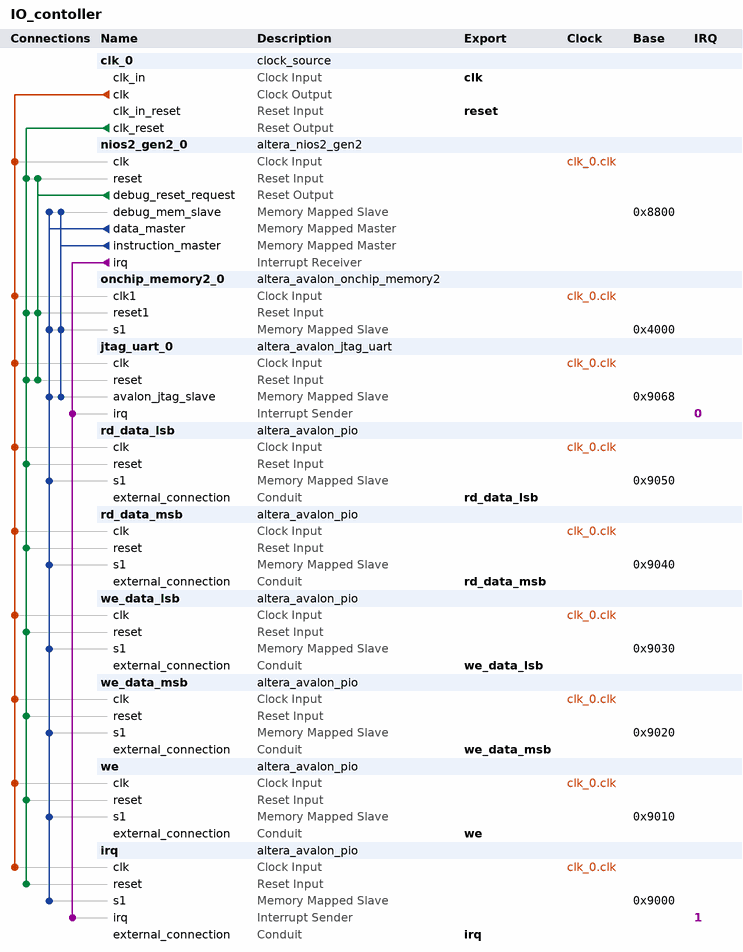
[diagram p0: system contents]
# Platform Designer (Qsys) system IO_contoller, Cyclone IV E EP4CE22F17C6
# Parameters at their usual value, and those the tool derives, are not listed.
package require -exact qsys 23.1
create_system IO_contoller
set_project_property DEVICE_FAMILY {Cyclone IV E}
set_project_property DEVICE EP4CE22F17C6

add_instance clk_0 clock_source 23.1
set_instance_parameter_value clk_0 clockFrequency 50000000

add_instance nios2_gen2_0 altera_nios2_gen2 23.1
set_instance_parameter_value nios2_gen2_0 dcache_size 2048
set_instance_parameter_value nios2_gen2_0 exceptionSlave onchip_memory2_0.s1
set_instance_parameter_value nios2_gen2_0 icache_size 4096
set_instance_parameter_value nios2_gen2_0 impl Tiny
set_instance_parameter_value nios2_gen2_0 resetSlave onchip_memory2_0.s1

add_instance onchip_memory2_0 altera_avalon_onchip_memory2 23.1
set_instance_parameter_value onchip_memory2_0 dataWidth 32
set_instance_parameter_value onchip_memory2_0 dualPort false
set_instance_parameter_value onchip_memory2_0 initMemContent true
set_instance_parameter_value onchip_memory2_0 initializationFileName onchip_mem.hex
set_instance_parameter_value onchip_memory2_0 memorySize 10240

add_instance jtag_uart_0 altera_avalon_jtag_uart 23.1
set_instance_parameter_value jtag_uart_0 simInteractiveOptions NO_INTERACTIVE_WINDOWS

add_instance rd_data_lsb altera_avalon_pio 23.1
set_instance_parameter_value rd_data_lsb direction Input
set_instance_parameter_value rd_data_lsb width 32

add_instance rd_data_msb altera_avalon_pio 23.1
set_instance_parameter_value rd_data_msb direction Input
set_instance_parameter_value rd_data_msb width 32

add_instance we_data_lsb altera_avalon_pio 23.1
set_instance_parameter_value we_data_lsb direction Output
set_instance_parameter_value we_data_lsb width 32

add_instance we_data_msb altera_avalon_pio 23.1
set_instance_parameter_value we_data_msb direction Output
set_instance_parameter_value we_data_msb width 32

add_instance we altera_avalon_pio 23.1
set_instance_parameter_value we direction Output
set_instance_parameter_value we width 1

add_instance irq altera_avalon_pio 23.1
set_instance_parameter_value irq direction Input
set_instance_parameter_value irq generateIRQ true
set_instance_parameter_value irq width 1

# connections
add_connection clk_0.clk irq.clk clock
add_connection clk_0.clk jtag_uart_0.clk clock
add_connection clk_0.clk nios2_gen2_0.clk clock
add_connection clk_0.clk onchip_memory2_0.clk1 clock
add_connection clk_0.clk rd_data_lsb.clk clock
add_connection clk_0.clk rd_data_msb.clk clock
add_connection clk_0.clk we.clk clock
add_connection clk_0.clk we_data_lsb.clk clock
add_connection clk_0.clk we_data_msb.clk clock
add_connection clk_0.clk_reset irq.reset reset
add_connection clk_0.clk_reset jtag_uart_0.reset reset
add_connection clk_0.clk_reset nios2_gen2_0.reset reset
add_connection clk_0.clk_reset onchip_memory2_0.reset1 reset
add_connection clk_0.clk_reset rd_data_lsb.reset reset
add_connection clk_0.clk_reset rd_data_msb.reset reset
add_connection clk_0.clk_reset we.reset reset
add_connection clk_0.clk_reset we_data_lsb.reset reset
add_connection clk_0.clk_reset we_data_msb.reset reset
add_connection nios2_gen2_0.debug_reset_request jtag_uart_0.reset reset
add_connection nios2_gen2_0.debug_reset_request nios2_gen2_0.reset reset
add_connection nios2_gen2_0.debug_reset_request onchip_memory2_0.reset1 reset
add_connection nios2_gen2_0.data_master irq.s1 avalon
set_connection_parameter_value nios2_gen2_0.data_master/irq.s1 baseAddress 0x9000
add_connection nios2_gen2_0.data_master jtag_uart_0.avalon_jtag_slave avalon
set_connection_parameter_value nios2_gen2_0.data_master/jtag_uart_0.avalon_jtag_slave baseAddress 0x9068
add_connection nios2_gen2_0.data_master nios2_gen2_0.debug_mem_slave avalon
set_connection_parameter_value nios2_gen2_0.data_master/nios2_gen2_0.debug_mem_slave baseAddress 0x8800
add_connection nios2_gen2_0.data_master onchip_memory2_0.s1 avalon
set_connection_parameter_value nios2_gen2_0.data_master/onchip_memory2_0.s1 baseAddress 0x4000
add_connection nios2_gen2_0.data_master rd_data_lsb.s1 avalon
set_connection_parameter_value nios2_gen2_0.data_master/rd_data_lsb.s1 baseAddress 0x9050
add_connection nios2_gen2_0.data_master rd_data_msb.s1 avalon
set_connection_parameter_value nios2_gen2_0.data_master/rd_data_msb.s1 baseAddress 0x9040
add_connection nios2_gen2_0.data_master we.s1 avalon
set_connection_parameter_value nios2_gen2_0.data_master/we.s1 baseAddress 0x9010
add_connection nios2_gen2_0.data_master we_data_lsb.s1 avalon
set_connection_parameter_value nios2_gen2_0.data_master/we_data_lsb.s1 baseAddress 0x9030
add_connection nios2_gen2_0.data_master we_data_msb.s1 avalon
set_connection_parameter_value nios2_gen2_0.data_master/we_data_msb.s1 baseAddress 0x9020
add_connection nios2_gen2_0.instruction_master jtag_uart_0.avalon_jtag_slave avalon
set_connection_parameter_value nios2_gen2_0.instruction_master/jtag_uart_0.avalon_jtag_slave baseAddress 0x9068
add_connection nios2_gen2_0.instruction_master nios2_gen2_0.debug_mem_slave avalon
set_connection_parameter_value nios2_gen2_0.instruction_master/nios2_gen2_0.debug_mem_slave baseAddress 0x8800
add_connection nios2_gen2_0.instruction_master onchip_memory2_0.s1 avalon
set_connection_parameter_value nios2_gen2_0.instruction_master/onchip_memory2_0.s1 baseAddress 0x4000
add_connection nios2_gen2_0.irq irq.irq interrupt
set_connection_parameter_value nios2_gen2_0.irq/irq.irq irqNumber 1
add_connection nios2_gen2_0.irq jtag_uart_0.irq interrupt
set_connection_parameter_value nios2_gen2_0.irq/jtag_uart_0.irq irqNumber 0

# exported interfaces
add_interface clk clock sink
set_interface_property clk EXPORT_OF clk_0.clk_in
add_interface irq conduit end
set_interface_property irq EXPORT_OF irq.external_connection
add_interface rd_data_lsb conduit end
set_interface_property rd_data_lsb EXPORT_OF rd_data_lsb.external_connection
add_interface rd_data_msb conduit end
set_interface_property rd_data_msb EXPORT_OF rd_data_msb.external_connection
add_interface reset reset sink
set_interface_property reset EXPORT_OF clk_0.clk_in_reset
add_interface we conduit end
set_interface_property we EXPORT_OF we.external_connection
add_interface we_data_lsb conduit end
set_interface_property we_data_lsb EXPORT_OF we_data_lsb.external_connection
add_interface we_data_msb conduit end
set_interface_property we_data_msb EXPORT_OF we_data_msb.external_connection

set_interconnect_requirement {$system} qsys_mm.clockCrossingAdapter HANDSHAKE
set_interconnect_requirement {$system} qsys_mm.enableEccProtection FALSE
set_interconnect_requirement {$system} qsys_mm.insertDefaultSlave FALSE
set_interconnect_requirement {$system} qsys_mm.maxAdditionalLatency 1

save_system IO_contoller.qsys
